# Altium schematic sheet 09_IO_Isolated_Interface.SchDoc
size A4; SheetNumber: 7; SheetTotal: 9
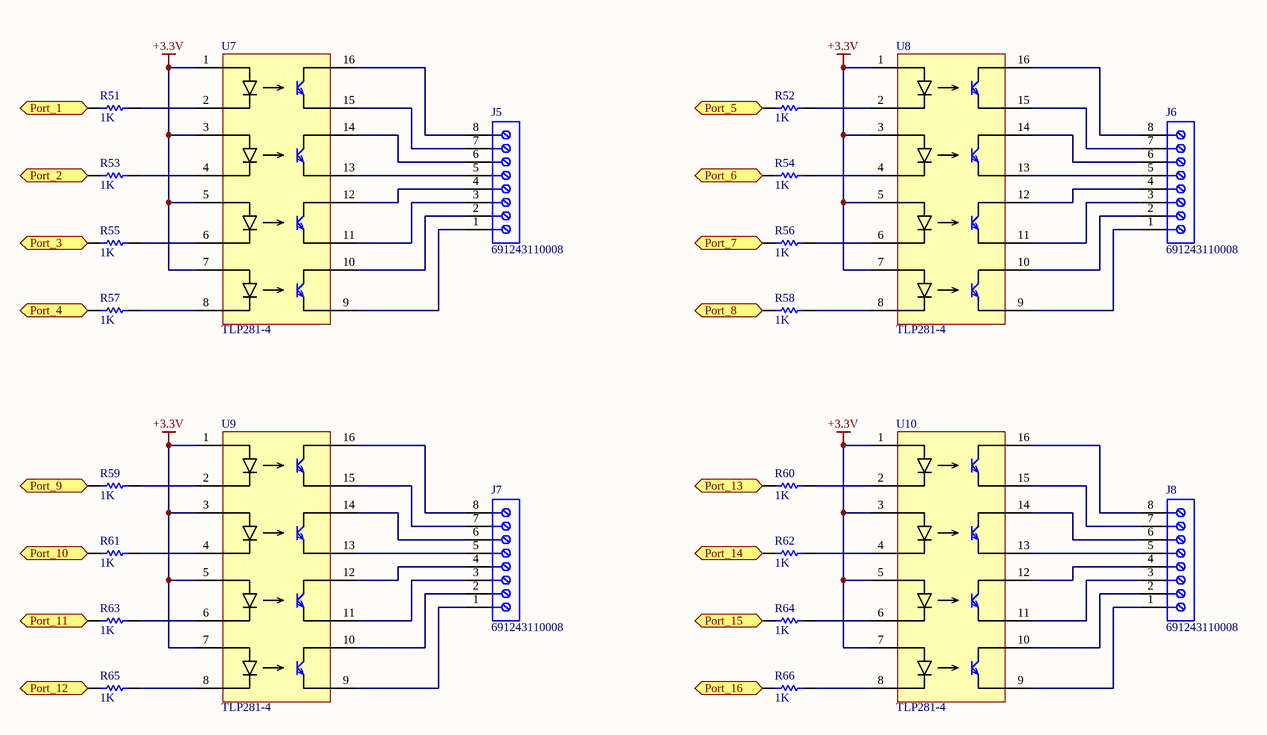
[diagram p0: 09_IO_Isolated_Interface.SchDoc]

## Parts
J5  691243110008  [691243110008]
J6  691243110008  [691243110008]
J7  691243110008  [691243110008]
J8  691243110008  [691243110008]
R51  value 1K  [RES-SM-0603]  (hidden comment: RESISTOR SMD)
R52  value 1K  [RES-SM-0603]  (hidden comment: RESISTOR SMD)
R53  value 1K  [RES-SM-0603]  (hidden comment: RESISTOR SMD)
R54  value 1K  [RES-SM-0603]  (hidden comment: RESISTOR SMD)
R55  value 1K  [RES-SM-0603]  (hidden comment: RESISTOR SMD)
R56  value 1K  [RES-SM-0603]  (hidden comment: RESISTOR SMD)
R57  value 1K  [RES-SM-0603]  (hidden comment: RESISTOR SMD)
R58  value 1K  [RES-SM-0603]  (hidden comment: RESISTOR SMD)
R59  value 1K  [RES-SM-0603]  (hidden comment: RESISTOR SMD)
R60  value 1K  [RES-SM-0603]  (hidden comment: RESISTOR SMD)
R61  value 1K  [RES-SM-0603]  (hidden comment: RESISTOR SMD)
R62  value 1K  [RES-SM-0603]  (hidden comment: RESISTOR SMD)
R63  value 1K  [RES-SM-0603]  (hidden comment: RESISTOR SMD)
R64  value 1K  [RES-SM-0603]  (hidden comment: RESISTOR SMD)
R65  value 1K  [RES-SM-0603]  (hidden comment: RESISTOR SMD)
R66  value 1K  [RES-SM-0603]  (hidden comment: RESISTOR SMD)
U7  TLP281-4  [SOIC127P700X210-16N]
U8  TLP281-4  [SOIC127P700X210-16N]
U9  TLP281-4  [SOIC127P700X210-16N]
U10  TLP281-4  [SOIC127P700X210-16N]

## Ports
Port_1 (bidir), Port_2 (bidir), Port_3 (bidir), Port_4 (bidir), Port_5 (bidir), Port_6 (bidir), Port_7 (bidir), Port_8 (bidir), Port_9 (bidir), Port_10 (bidir), Port_11 (bidir), Port_12 (bidir), Port_13 (bidir), Port_14 (bidir), Port_15 (bidir), Port_16 (bidir)

## Nets
+3.3V: U7.1(A1) U7.3(A2) U7.5(A3) U7.7(A4) U8.1(A1) U8.3(A2) U8.5(A3) U8.7(A4) U9.1(A1) U9.3(A2) U9.5(A3) U9.7(A4) U10.1(A1) U10.3(A2) U10.5(A3) U10.7(A4)
Port_1: R51.1 ; port Port_1
Port_2: R53.1 ; port Port_2
Port_3: R55.1 ; port Port_3
Port_4: R57.1 ; port Port_4
Port_5: R52.1 ; port Port_5
Port_6: R54.1 ; port Port_6
Port_7: R56.1 ; port Port_7
Port_8: R58.1 ; port Port_8
Port_9: R59.1 ; port Port_9
Port_10: R61.1 ; port Port_10
Port_11: R63.1 ; port Port_11
Port_12: R65.1 ; port Port_12
Port_13: R60.1 ; port Port_13
Port_14: R62.1 ; port Port_14
Port_15: R64.1 ; port Port_15
Port_16: R66.1 ; port Port_16
NetJ5_1: J5.1 U7.9(E4)
NetJ5_2: J5.2 U7.10(COL4)
NetJ5_3: J5.3 U7.11(E3)
NetJ5_4: J5.4 U7.12(COL3)
NetJ5_5: J5.5 U7.13(E2)
NetJ5_6: J5.6 U7.14(COL2)
NetJ5_7: J5.7 U7.15(E1)
NetJ5_8: J5.8 U7.16(COL1)
NetJ6_1: J6.1 U8.9(E4)
NetJ6_2: J6.2 U8.10(COL4)
NetJ6_3: J6.3 U8.11(E3)
NetJ6_4: J6.4 U8.12(COL3)
NetJ6_5: J6.5 U8.13(E2)
NetJ6_6: J6.6 U8.14(COL2)
NetJ6_7: J6.7 U8.15(E1)
NetJ6_8: J6.8 U8.16(COL1)
NetJ7_1: J7.1 U9.9(E4)
NetJ7_2: J7.2 U9.10(COL4)
NetJ7_3: J7.3 U9.11(E3)
NetJ7_4: J7.4 U9.12(COL3)
NetJ7_5: J7.5 U9.13(E2)
NetJ7_6: J7.6 U9.14(COL2)
NetJ7_7: J7.7 U9.15(E1)
NetJ7_8: J7.8 U9.16(COL1)
NetJ8_1: J8.1 U10.9(E4)
NetJ8_2: J8.2 U10.10(COL4)
NetJ8_3: J8.3 U10.11(E3)
NetJ8_4: J8.4 U10.12(COL3)
NetJ8_5: J8.5 U10.13(E2)
NetJ8_6: J8.6 U10.14(COL2)
NetJ8_7: J8.7 U10.15(E1)
NetJ8_8: J8.8 U10.16(COL1)
NetR51_2: R51.2 U7.2(C1)
NetR52_2: R52.2 U8.2(C1)
NetR53_2: R53.2 U7.4(C2)
NetR54_2: R54.2 U8.4(C2)
NetR55_2: R55.2 U7.6(C3)
NetR56_2: R56.2 U8.6(C3)
NetR57_2: R57.2 U7.8(C4)
NetR58_2: R58.2 U8.8(C4)
NetR59_2: R59.2 U9.2(C1)
NetR60_2: R60.2 U10.2(C1)
NetR61_2: R61.2 U9.4(C2)
NetR62_2: R62.2 U10.4(C2)
NetR63_2: R63.2 U9.6(C3)
NetR64_2: R64.2 U10.6(C3)
NetR65_2: R65.2 U9.8(C4)
NetR66_2: R66.2 U10.8(C4)

## Library data of the parts
J5-J8 = 691243110008: WR-TBL Serie 2431 Horizontal Cable Entry, Rising Cage Clamp, pitch 3.5mm, 8p; Compliance: Lead free / RoHS; Modularity: No; PCB/Cable/Panel: PCB; Pin Number: 8; Rated Current [UL]: 10A; Working Voltage [UL]: 300VAC; ComponentLink1Description: Manufacturer; ComponentLink1URL: http://www.we-online.de; ComponentLink2URL: https://katalog.we-online.de/em/datasheet/691243110008.pdf; ComponentLink2Description: Datasheet; Mounting Technology: THT; Part Number: 691243110008; Packaging: Box; Operating Temperature: -30 to +120degC; Pitch: 3.5mm; Published Date: October 2019; Type: Horizontal; Publisher: Wurth Elektronik; Application: Rising Cage Clamp
R51-R66 = RESISTOR SMD: Resistor